# Altium schematic sheet CAN.SchDoc
size A4; SheetNumber: 10; SheetTotal: 11
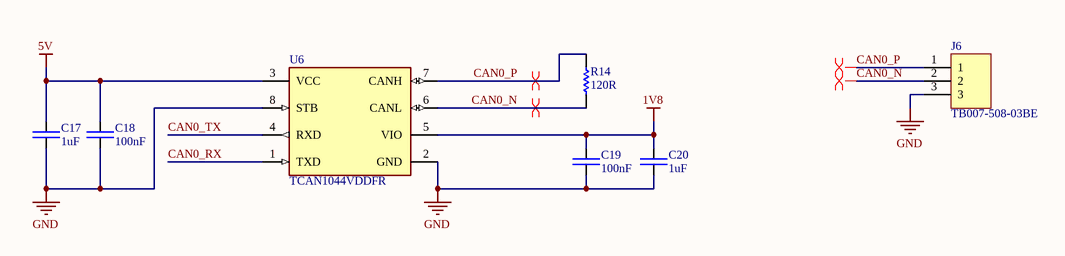
[diagram p0: CAN.SchDoc]

## Parts
C17  1uF  [CAP-0805]
C18  100nF  [CAP-0603]
C19  100nF  [CAP-0603]
C20  1uF  [CAP-0805]
J6  TB007-508-03BE  [CUI_TB007-508-03BE]
R14  120R  [RES-0603]
U6  TCAN1044VDDFR  [FP-DDF0008A-MFG]

## Nets
1V8: C19.2 C20.2 U6.5(VIO)
5V: C17.2 C18.2 U6.3(VCC)
GND: C17.1 C18.1 C19.1 C20.1 J6.3 U6.2(GND) U6.8(STB)
CAN0_N: J6.2 R14.1 U6.6(CANL)
CAN0_P: J6.1 R14.2 U6.7(CANH)
CAN0_RX: U6.1(TXD)
CAN0_TX: U6.4(RXD)

## Layout directives
differential pair: CAN0_N, CAN0_P

## Library data of the parts
C17 C20 = CAP-0805: Capacitor chip unpolarized. 0805
C18 C19 = CAP-0603: Capacitor chip unpolarized. 0603
J6 = TB007-508-03BE: 3 Pos, Screw Type, Horizontal, 5.08 Pitch, 24~12 (AWG), Terminal Block Connector; MF: Same Sky; SnapEDA_Link: https://www.snapeda.com/parts/TB007-508-03BE/Same+Sky/view-part/?ref=snap; Package: None; Value: *; MP: TB007-508-03BE; Check_prices: https://www.snapeda.com/parts/TB007-508-03BE/Same+Sky/view-part/?ref=eda
R14 = RES-0603: Resistor chip. 0603
U6 = CMP-04872-000216-1: IC TRANSCEIVER FULL 1/1 SOT23-8